# Altium schematic sheet obc-v2_OUT-eMMC.SchDoc
size 420 x 297 mm; SheetNumber: 4; SheetTotal: 21
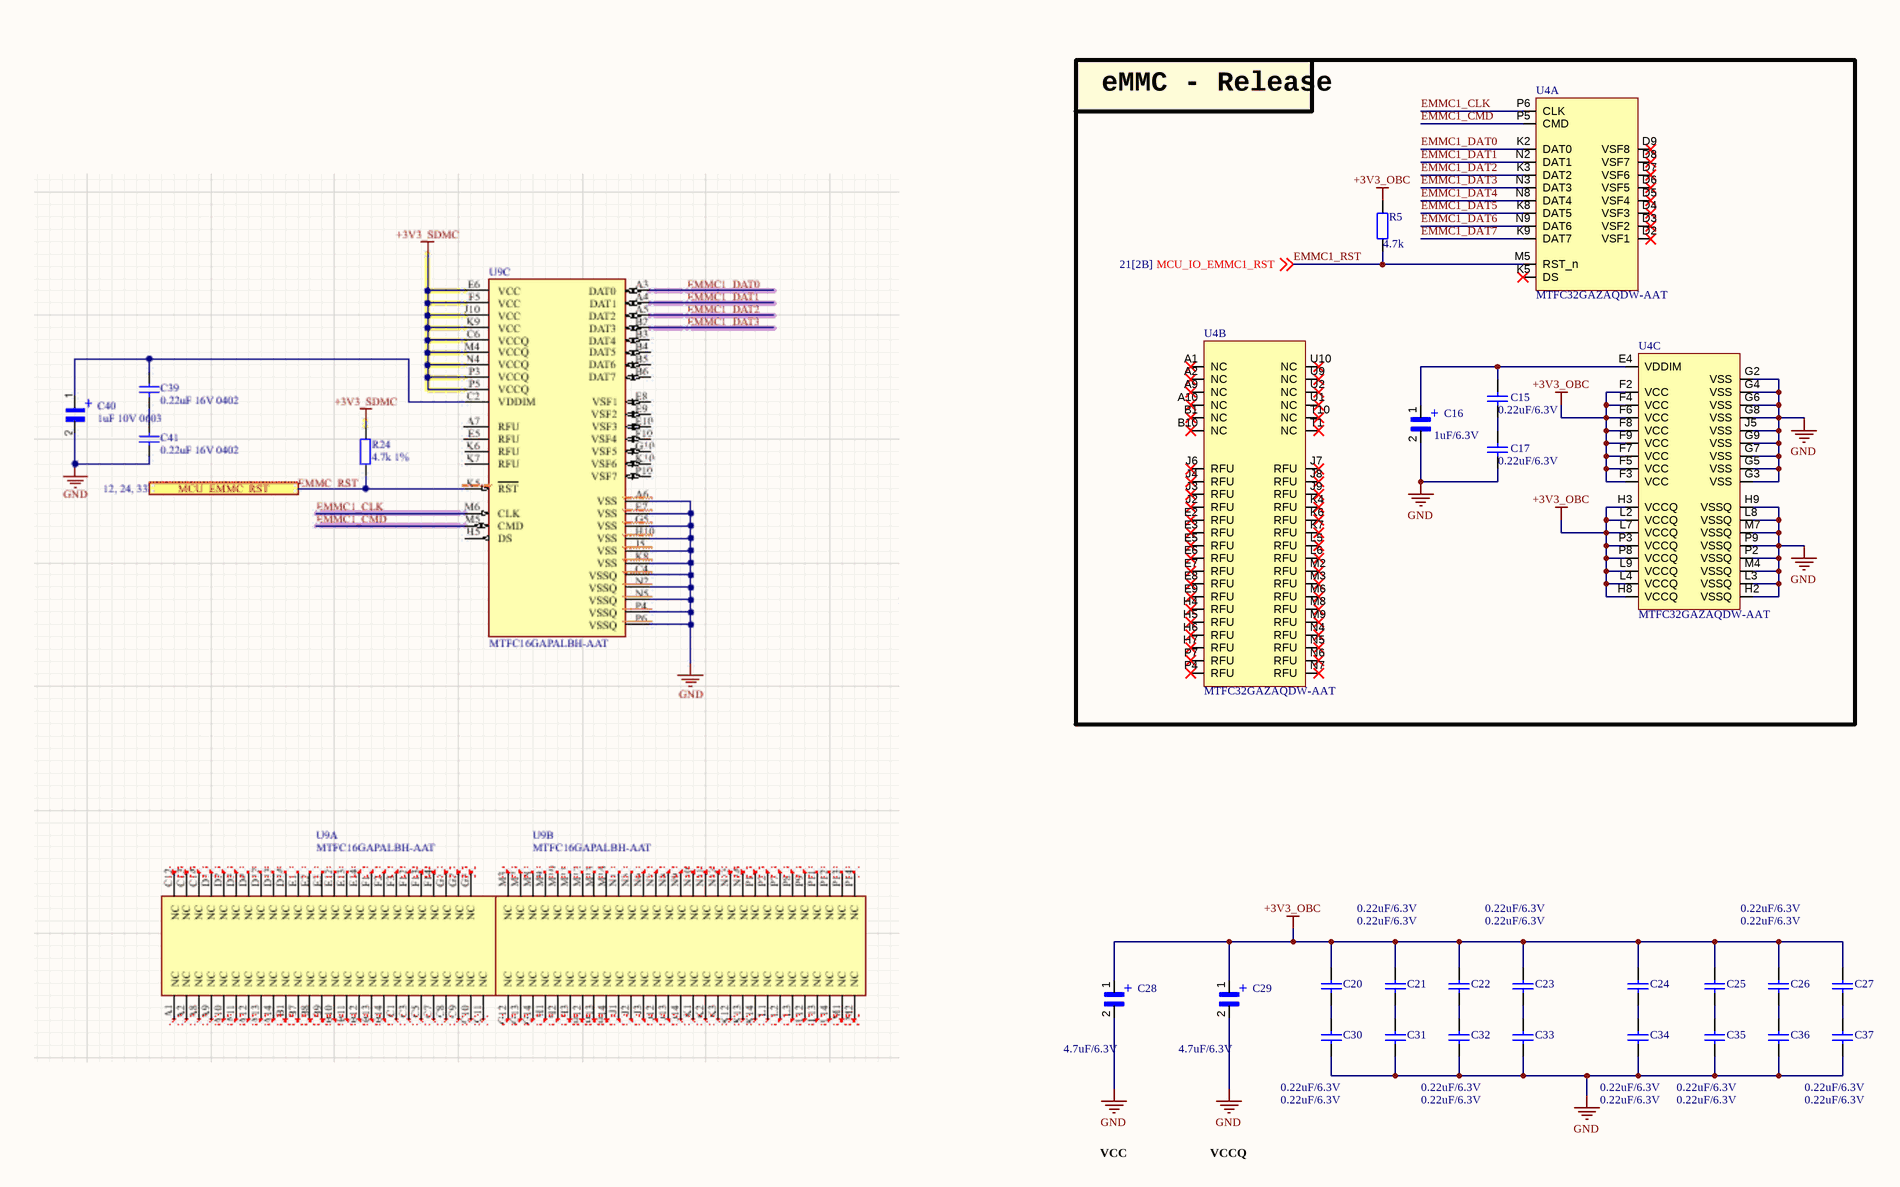
[diagram p0: obc-v2_OUT-eMMC.SchDoc, left]
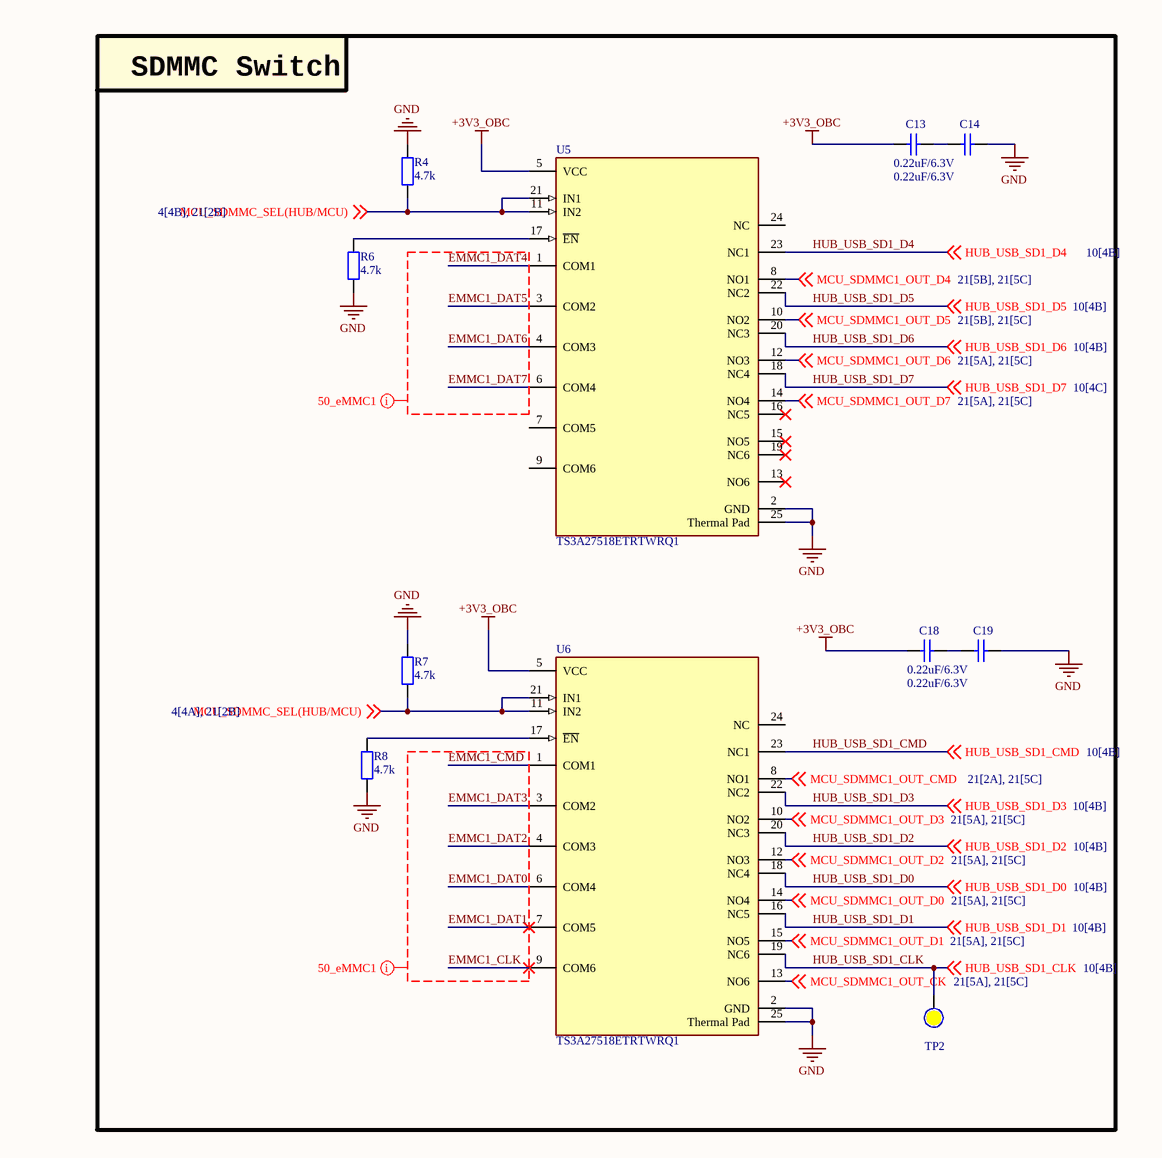
[diagram p1: obc-v2_OUT-eMMC.SchDoc, right]

## Parts
C13  0.22uF/6.3V  [CAP_C_1005X60]
C14  0.22uF/6.3V  [CAP_C_1005X60]
C15  0.22uF/6.3V  [CAP_C_1005X60]
C16  1uF/6.3V  [CAP_MP_1608X90]
C17  0.22uF/6.3V  [CAP_C_1005X60]
C18  0.22uF/6.3V  [CAP_C_1005X60]
C19  0.22uF/6.3V  [CAP_C_1005X60]
C20  0.22uF/6.3V  [CAP_C_1005X60]
C21  0.22uF/6.3V  [CAP_C_1005X60]
C22  0.22uF/6.3V  [CAP_C_1005X60]
C23  0.22uF/6.3V  [CAP_C_1005X60]
C24  0.22uF/6.3V  [CAP_C_1005X60]
C25  0.22uF/6.3V  [CAP_C_1005X60]
C26  0.22uF/6.3V  [CAP_C_1005X60]
C27  0.22uF/6.3V  [CAP_C_1005X60]
C28  4.7uF/6.3V  [CAP_MP_1608X90]
C29  4.7uF/6.3V  [CAP_MP_1608X90]
C30  0.22uF/6.3V  [CAP_C_1005X60]
C31  0.22uF/6.3V  [CAP_C_1005X60]
C32  0.22uF/6.3V  [CAP_C_1005X60]
C33  0.22uF/6.3V  [CAP_C_1005X60]
C34  0.22uF/6.3V  [CAP_C_1005X60]
C35  0.22uF/6.3V  [CAP_C_1005X60]
C36  0.22uF/6.3V  [CAP_C_1005X60]
C37  0.22uF/6.3V  [CAP_C_1005X60]
R4  4.7k  [RES_C_1608X60]
R5  4.7k  [RES_C_1608X60]
R6  4.7k  [RES_C_1608X60]
R7  4.7k  [RES_C_1608X60]
R8  4.7k  [RES_C_1608X60]
TP2  (no value)  [Test Point 1 Side]  (no BOM)
U4  MTFC32GAZAQDW-AAT  [BGA_100_C_100P_10X17_1400X1800X150]  (parts A,B,C of 3)
U5  TS3A27518ETRTWRQ1  [FP-RTW0024B-IPC_A]
U6  TS3A27518ETRTWRQ1  [FP-RTW0024B-IPC_A]

## Blocks framed on the sheet
eMMC - Release: C15-C17 R5 U4
SDMMC Switch: C13 C14 C18 C19 R4 R6-R8 TP2 U5 U6

## Nets
+3V3_OBC: C13.2 C18.2 C20.1 C21.1 C22.1 C23.1 C24.1 C25.1 C26.1 C27.1 C28.1 C29.1 R5.1 U4.F2(VCC) U4.F3(VCC) U4.F4(VCC) U4.F5(VCC) U4.F6(VCC) U4.F7(VCC) U4.F8(VCC) U4.F9(VCC) U4.H3(VCCQ) U4.H8(VCCQ) U4.L2(VCCQ) U4.L4(VCCQ) U4.L7(VCCQ) U4.L9(VCCQ) U4.P3(VCCQ) U4.P8(VCCQ) U5.5(VCC) U6.5(VCC)
GND: C14.1 C16.2 C17.2 C19.1 C28.2 C29.2 C30.2 C31.2 C32.2 C33.2 C34.2 C35.2 C36.2 C37.2 R4.1 R6.2 R7.1 R8.2 U4.G2(VSS) U4.G3(VSS) U4.G4(VSS) U4.G5(VSS) U4.G6(VSS) U4.G7(VSS) U4.G8(VSS) U4.G9(VSS) U4.H2(VSSQ) U4.H9(VSSQ) U4.J5(VSS) U4.L3(VSSQ) U4.L8(VSSQ) U4.M4(VSSQ) U4.M7(VSSQ) U4.P2(VSSQ) U4.P9(VSSQ) U5.2(GND) U5.25(Thermal_Pad) U6.2(GND) U6.25(Thermal_Pad)
EMMC1_CLK: U4.P6(CLK) U6.9(COM6)
EMMC1_CMD: U4.P5(CMD) U6.1(COM1)
EMMC1_DAT0: U4.K2(DAT0) U6.6(COM4)
EMMC1_DAT1: U4.N2(DAT1) U6.7(COM5)
EMMC1_DAT2: U4.K3(DAT2) U6.4(COM3)
EMMC1_DAT3: U4.N3(DAT3) U6.3(COM2)
EMMC1_DAT4: U4.N8(DAT4) U5.1(COM1)
EMMC1_DAT5: U4.K8(DAT5) U5.3(COM2)
EMMC1_DAT6: U4.N9(DAT6) U5.4(COM3)
EMMC1_DAT7: U4.K9(DAT7) U5.6(COM4)
EMMC1_RST: R5.2 U4.M5(RST_n) ; off-sheet MCU_IO_EMMC1_RST  [also labelled MCU_IO_EMMC1_RST]
HUB_USB_SD1_CLK: TP2.0 U6.19(NC6) ; off-sheet HUB_USB_SD1_CLK
HUB_USB_SD1_CMD: U6.23(NC1) ; off-sheet HUB_USB_SD1_CMD
HUB_USB_SD1_D0: U6.18(NC4) ; off-sheet HUB_USB_SD1_D0
HUB_USB_SD1_D1: U6.16(NC5) ; off-sheet HUB_USB_SD1_D1
HUB_USB_SD1_D2: U6.20(NC3) ; off-sheet HUB_USB_SD1_D2
HUB_USB_SD1_D3: U6.22(NC2) ; off-sheet HUB_USB_SD1_D3
HUB_USB_SD1_D4: U5.23(NC1) ; off-sheet HUB_USB_SD1_D4
HUB_USB_SD1_D5: U5.22(NC2) ; off-sheet HUB_USB_SD1_D5
HUB_USB_SD1_D6: U5.20(NC3) ; off-sheet HUB_USB_SD1_D6
HUB_USB_SD1_D7: U5.18(NC4) ; off-sheet HUB_USB_SD1_D7
MCU_SDMMC1_OUT_CK: U6.13(NO6) ; off-sheet MCU_SDMMC1_OUT_CK
MCU_SDMMC1_OUT_CMD: U6.8(NO1) ; off-sheet MCU_SDMMC1_OUT_CMD
MCU_SDMMC1_OUT_D0: U6.14(NO4) ; off-sheet MCU_SDMMC1_OUT_D0
MCU_SDMMC1_OUT_D1: U6.15(NO5) ; off-sheet MCU_SDMMC1_OUT_D1
MCU_SDMMC1_OUT_D2: U6.12(NO3) ; off-sheet MCU_SDMMC1_OUT_D2
MCU_SDMMC1_OUT_D3: U6.10(NO2) ; off-sheet MCU_SDMMC1_OUT_D3
MCU_SDMMC1_OUT_D4: U5.8(NO1) ; off-sheet MCU_SDMMC1_OUT_D4
MCU_SDMMC1_OUT_D5: U5.10(NO2) ; off-sheet MCU_SDMMC1_OUT_D5
MCU_SDMMC1_OUT_D6: U5.12(NO3) ; off-sheet MCU_SDMMC1_OUT_D6
MCU_SDMMC1_OUT_D7: U5.14(NO4) ; off-sheet MCU_SDMMC1_OUT_D7
MCU_SDMMC_SEL(HUB/MCU): R4.2 R7.2 U5.11(IN2) U5.21(IN1) U6.11(IN2) U6.21(IN1) ; off-sheet MCU_SDMMC_SEL(HUB/MCU)
NetC13_1: C13.1 C14.2
NetC15_1: C15.1 C16.1 U4.E4(VDDIM)
NetC15_2: C15.2 C17.1
NetC18_1: C18.1 C19.2
NetC20_2: C20.2 C30.1
NetC21_2: C21.2 C31.1
NetC22_2: C22.2 C32.1
NetC23_2: C23.2 C33.1
NetC24_2: C24.2 C34.1
NetC25_2: C25.2 C35.1
NetC26_2: C26.2 C36.1
NetC27_2: C27.2 C37.1
NetR6_1: R6.1 U5.17(~{EN})
NetR8_1: R8.1 U6.17(~{EN})

Not connected (* = marked no-connect by the designer): U4 A1(NC)* A2(NC)* A9(NC)* A10(NC)* B1(NC)* B10(NC)* D2(VSF1)* D3(VSF2)* D4(VSF3)* D5(VSF4)* D6(VSF5)* D7(VSF6)* D8(VSF7)* D9(VSF8)* E2(RFU)* E3(RFU)* E5(RFU)* E6(RFU)* E7(RFU)* E8(RFU)* E9(RFU)* H4(RFU)* H5(RFU)* H6(RFU)* H7(RFU)* J2(RFU)* J3(RFU)* J4(RFU)* J6(RFU)* J7(RFU)* J8(RFU)* J9(RFU)* K4(RFU)* K5(DS)* K6(RFU)* K7(RFU)* L5(RFU)* L6(RFU)* M2(RFU)* M3(RFU)* M6(RFU)* M8(RFU)* M9(RFU)* N4(RFU)* N5(RFU)* N6(RFU)* N7(RFU)* P4(RFU)* P7(RFU)* T1(NC)* T10(NC)* U1(NC)* U2(NC)* U9(NC)* U10(NC)*; U5 7(COM5) 9(COM6) 13(NO6)* 15(NO5)* 16(NC5)* 19(NC6)* 24(NC); U6 24(NC)

## Layout directives
net class 50_eMMC1: EMMC1_CLK, EMMC1_CMD, EMMC1_DAT0, EMMC1_DAT1, EMMC1_DAT2, EMMC1_DAT3, EMMC1_DAT4, EMMC1_DAT5, EMMC1_DAT6, EMMC1_DAT7

## Notes on the sheet
- VCC
- VCCQ
- Project:
- Sub-system:
- Design by:
- Sheet title:
- Sheet
- A3
- of
- Checked by:
- Approved by:
- Revision:
- Document No:
- Size:
- Date:
- (in symbol TACL335M003RTA) +

## Library data of the parts
C13-C15 C17-C27 C30-C37 = Tu 0402 33nF 10V: CAPC; Chung_Loai: Dán; Don_Vi: Con; So_Chan: 2; Ten_Linh_Kien: Tụ 0402 33nF X7R 10V GRM155R71A333KA01D; Ma_Hang: MH007853; Kieu_Chan: *
C16 C28 C29 = TACL335M003RTA: CAPP; Package: None; Price: None; Value: *; MP: TACL335M003RTA; Availability: Unavailable
R4-R8 = Tro 0603 1% 10k: RES; Chung_Loai: Dán; Don_Vi: Con; So_Chan: 2; Ten_Linh_Kien: Trở 0603 1% 10k; Ma_Hang: MH006333; Kieu_Chan: *
TP2 = Test Point: Solder: NF
U5 U6 = CMP-04892-000110-1: IC MUX/DEMUX 1X2 24WQFN; Supply Type: Single; Max Supply Voltage: 3.6V; Number of Circuits: 6; On-State Resistance: 6.2R; Turn-Off Delay Time: 70ns; -3db Bandwidth: 240MHz; Operating Supply Current: 40nA; Min Supply Voltage: 1.65V; Logic Function: Multiplexer; Turn-On Delay Time: 68ns; Min Operating Temperature: -40°C; Packaging: Tape and Reel; Case/Package: QFN; Package Quantity: 1; RoHS Compliant: Yes; Lead Free: Lead Free; Bandwidth: 240MHz; Max Operating Temperature: 105°C; Number of Channels: 6; Series: Automotive, AEC-Q100; Number of Pins: 24; Mount: Surface Mount